# EAGLE design parallel_jtag_programmer (EAGLE 7.6.0)
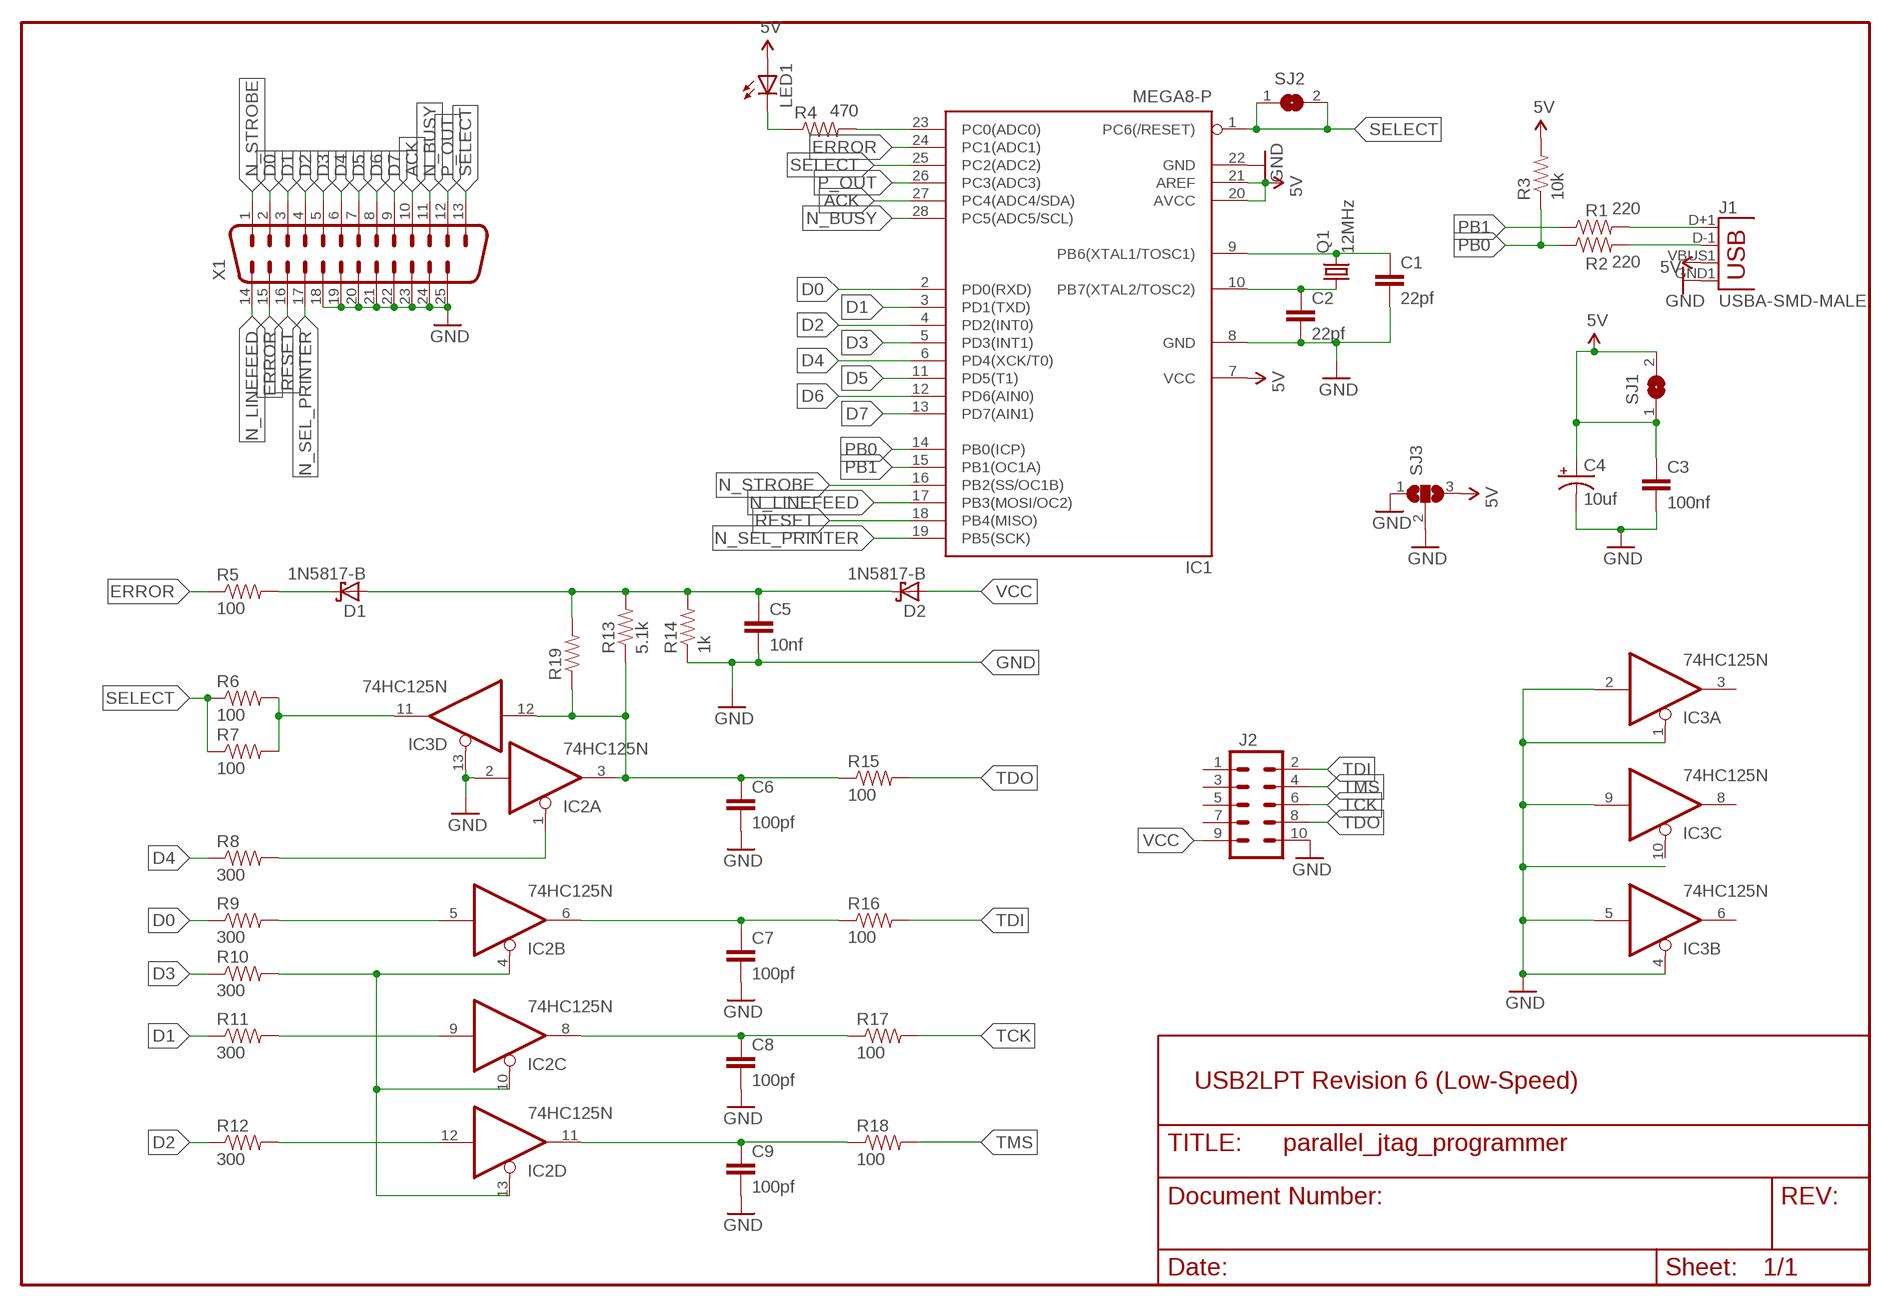
[diagram p0: schematic, sheet 1]

## Parts
C1  22pf  CAPPTH  [CAP-PTH-SMALL]
C2  22pf  CAPPTH  [CAP-PTH-SMALL]
C3  100nf  CAPPTH1  [CAP-PTH-5MM]
C4  10uf  CAP_POLPTH2  [CPOL-RADIAL-10UF-25V]
C5  10nf  CAPPTH  [CAP-PTH-SMALL]
C6  100pf  CAPPTH1  [CAP-PTH-5MM]
C7  100pf  CAPPTH1  [CAP-PTH-5MM]
C8  100pf  CAPPTH1  [CAP-PTH-5MM]
C9  100pf  CAPPTH1  [CAP-PTH-5MM]
D1  1N5817-B  [DO41-7.6]
D2  1N5817-B  [DO41-7.6]
IC1  MEGA8-P  [DIL28-3]
IC2  74HC125N  [DIL14]
IC3  74HC125N  [DIL14]
J1  USBA-SMD-MALE  [USB-A-SMT-MALE]
J2  M05X2SHD  [2X5-SHROUDED]
LED1  LED3MM  [LED3MM]
Q1  12MHz  CRYSTALHC49U-V  [HC49U-V]
R1  220  RESISTORAXIAL-0.3  [AXIAL-0.3]
R2  220  RESISTORAXIAL-0.3  [AXIAL-0.3]
R3  10k  RESISTORAXIAL-0.3  [AXIAL-0.3]
R4  470  RESISTORAXIAL-0.3  [AXIAL-0.3]
R5  100  RESISTORAXIAL-0.3  [AXIAL-0.3]
R6  100  RESISTORAXIAL-0.3  [AXIAL-0.3]
R7  100  RESISTORAXIAL-0.3  [AXIAL-0.3]
R8  300  RESISTORAXIAL-0.3  [AXIAL-0.3]
R9  300  RESISTORAXIAL-0.3  [AXIAL-0.3]
R10  300  RESISTORAXIAL-0.3  [AXIAL-0.3]
R11  300  RESISTORAXIAL-0.3  [AXIAL-0.3]
R12  300  RESISTORAXIAL-0.3  [AXIAL-0.3]
R13  5.1k  RESISTORAXIAL-0.3  [AXIAL-0.3]
R14  1k  RESISTORAXIAL-0.3  [AXIAL-0.3]
R15  100  RESISTORAXIAL-0.3  [AXIAL-0.3]
R16  100  RESISTORAXIAL-0.3  [AXIAL-0.3]
R17  100  RESISTORAXIAL-0.3  [AXIAL-0.3]
R18  100  RESISTORAXIAL-0.3  [AXIAL-0.3]
R19  RESISTORAXIAL-0.3  [AXIAL-0.3]
SJ1  SJ  [SJ]
SJ2  SJ  [SJ]
SJ3  SJ2W  [SJ_2]
X1  DB25H  [M25H]

## Nets
5V: C3.1 C4.1(+) IC1.7(VCC) IC1.20(AVCC) IC1.21(AREF) J1.VBUS1(VBUS) LED1.A R3.P$2 SJ1.1 SJ1.2 SJ3.3
ACK: IC1.27(PC4(ADC4/SDA)) X1.10
D0: IC1.2(PD0(RXD)) R9.P$1 X1.2
D1: IC1.3(PD1(TXD)) R11.P$1 X1.3
D2: IC1.4(PD2(INT0)) R12.P$1 X1.4
D3: IC1.5(PD3(INT1)) R10.P$1 X1.5
D4: IC1.6(PD4(XCK/T0)) R8.P$1 X1.6
D5: IC1.11(PD5(T1)) X1.7
D6: IC1.12(PD6(AIN0)) X1.8
D7: IC1.13(PD7(AIN1)) X1.9
ERROR: IC1.24(PC1(ADC1)) R5.P$1 X1.15
GND: C1.2 C2.2 C3.2 C4.2(-) C5.2 C6.2 C7.2 C8.2 C9.2 IC1.8(GND) IC1.22(GND) IC2.2(A:I) IC3.1(A:OE) IC3.2(A:I) IC3.4(B:OE) IC3.5(B:I) IC3.9(C:I) IC3.13(D:OE) J1.GND1(GND) J2.10 R14.P$1 SJ3.1 SJ3.2 X1.18 X1.19 X1.20 X1.21 X1.22 X1.23 X1.24 X1.25
N$1: LED1.K(C) R4.P$1
N$2: IC1.23(PC0(ADC0)) R4.P$2
N$3: C5.1 D1.A D2.C R13.P$2 R14.P$2 R19.P$2
N$4: C2.1 IC1.10(PB7(XTAL2/TOSC2)) Q1.1
N$5: C1.1 IC1.9(PB6(XTAL1/TOSC1)) Q1.2
N$6: J1.D-1(D-) R2.P$2
N$7: J1.D+1(D+) R1.P$2
N$9: C6.1 IC2.3(A:O) IC3.12(D:I) R13.P$1 R15.P$1 R19.P$1
N$10: IC2.1(A:OE) R8.P$2
N$11: IC3.11(D:O) R6.P$2 R7.P$2
N$13: IC2.5(B:I) R9.P$2
N$14: IC2.4(B:OE) IC2.10(C:OE) IC2.13(D:OE) R10.P$2
N$15: D1.C R5.P$2
N$16: C7.1 IC2.6(B:O) R16.P$1
N$18: C8.1 IC2.8(C:O) R17.P$1
N$19: IC2.9(C:I) R11.P$2
N$20: IC2.12(D:I) R12.P$2
N$23: C9.1 IC2.11(D:O) R18.P$1
N_BUSY: IC1.28(PC5(ADC5/SCL)) X1.11
N_LINEFEED: IC1.17(PB3(MOSI/OC2)) X1.14
N_SEL_PRINTER: IC1.19(PB5(SCK)) X1.17
N_STROBE: IC1.16(PB2(SS/OC1B)) X1.1
P_OUT: IC1.26(PC3(ADC3)) X1.12
PB0: IC1.14(PB0(ICP)) R2.P$1 R3.P$1
PB1: IC1.15(PB1(OC1A)) R1.P$1
RESET: IC1.18(PB4(MISO)) X1.16
SELECT: IC1.1(PC6(/RESET)) IC1.25(PC2(ADC2)) R6.P$1 R7.P$1 SJ2.1 SJ2.2 X1.13
TCK: J2.6
TDI: J2.2 R16.P$2
TDO: J2.8 R15.P$2
TMS: J2.4 R18.P$2
VCC: D2.A J2.9
Unconnected: IC3.3(A:O) IC3.6(B:O) IC3.8(C:O) IC3.10(C:OE) J2.1 J2.3 J2.5 J2.7 R17.P$2

## Notes on the sheet
- USB2LPT Revision 6 (Low-Speed)

## Power pins joined to a net without a drawn wire
GND: IC2.7(P:GND) IC3.7(P:GND)
VCC: IC2.14(P:VCC) IC3.14(P:VCC)

## Library data of the parts
C1-C3 C5-C9 = SparkFun-Passives:CAP: Capacitor Standard 0603 ceramic capacitor, and 0.1" leaded capacitor.
C4 = SparkFun-Passives:CAP_POL: Capacitor Polarized These are standard SMD and PTH capacitors. Normally 10uF, 47uF, and 100uF in electrolytic and tantalum varieties. Always verify the external diameter of the through hole cap, it varies with capacity, voltage, and manufacturer. The EIA devices should be standard.
D1 D2 = diode:1N581*: 1.0A SCHOTTKY BARRIER RECTIFIER Source: http://www.diodes.com/datasheets/ds23001.pdf
IC1 = atmel:MEGA8-P: MICROCONTROLLER 8 Kbytes FLASH, 1 kbytes SRAM, 512 bytes EEPROM, USART, 4-channel 10 bit ADC, 2-channel 8 bit ADC Pin compatible with Atmega48, ATMega88, ATMega168 Source: avr.lbr; OC_FARNELL: unknown; OC_NEWARK: unknown
IC2 IC3 = 74xx-eu:74*125: Quad bus BUFFER, 3-state
J1 = SparkFun-Connectors:USB: USB Connectors USB-B-PTH is fully proven SKU : PRT-00139/CONN-08278 USB-miniB is fully proven SKU : PRT-00587 USB-A-PCB is untested. USB-A-H is throughly reviewed, but untested. Spark Fun Electronics SKU : PRT-00437 USB-B-SMT is throughly reviewed, but untested. Needs silkscreen touching up. USB-A-S has not been used/tested USB-MB-H has not been used/tested USB-MICROB has been used. CONN-09505
J2 = SparkFun-Connectors:M05X2: Header 5x2 Standard 10-pin dual row 0.1" header. Commonly used with AVR-ISP. Use with Spark Fun Electronics SKU: PRT-00778
LED1 = adafruit:LED: LED OSRAM: - CHIPLED LG R971, LG N971, LY N971, LG Q971, LY Q971, LO R971, LY R971 LH N974, LH R974 LS Q976, LO Q976, LY Q976 LO Q996 - Hyper CHIPLED LW Q18S LB Q993, LB Q99A, LB R99A - SideLED LS A670, LO A670, LY A670, LG A670, LP A670 LB A673, LV A673, LT A673, LW A673 LH A674 LY A675 LS A676, LA A676, LO A676, LY A676, LW A676 LS A679, LY A679, LG A679 - Hyper Micro SIDELED® LS Y876, LA Y876, LO Y876, LY Y876 LT Y87S - SmartLED LW L88C, LW L88S LB L89C, LB L89S, LG L890 LS L89K, LO L89K, LY L89K LS L896, LA L896, LO L896, LY L896 - TOPLED LS T670, LO T670, LY T670, LG T670, LP T670 LSG T670, LSP T670, LSY T670, LOP T670, LYG T670 LG T671, LOG T671, LSG T671 LB T673, LV T673, LT T673, LW T673 LH T674 LS T676, LA T676, LO T676, LY T676, LB T676, LH T676, LSB T676, LW T676 LB T67C, LV T67C, LT T67C, LS T67K, LO T67K, LY T67K, LW E67C LS E67B, LA E67B, LO E67B, LY E67B, LB E67C, LV E67C, LT E67C LW T67C LS T679, LY T679, LG T679 LS T770, LO T770, LY T770, LG T770, LP T770 LB T773, LV T773, LT T773, LW T773 LH T774 LS E675, LA E675, LY E675, LS T675 LS T776, LA T776, LO T776, LY T776, LB T776 LHGB T686 LT T68C, LB T68C - Hyper Mini TOPLED® LB M676 - Mini TOPLED Santana® LG M470 LS M47K, LO M47K, LY M47K Source: http://www.osram.convergy.de/
Q1 = crystal:CRYSTAL: CRYSTAL; OC_FARNELL: 1666969; OC_NEWARK: unknown
R1-R19 = SparkFun-Passives:RESISTOR: Resistor Basic schematic elements and footprints for 0603, 1206, and PTH resistors.
SJ1 SJ2 = jumper:SJ: SMD solder JUMPER
SJ3 = jumper:SJ2W: SMD solder JUMPER
X1 = SparkFun-Connectors:DB25: Various DB25 connectors

## Board
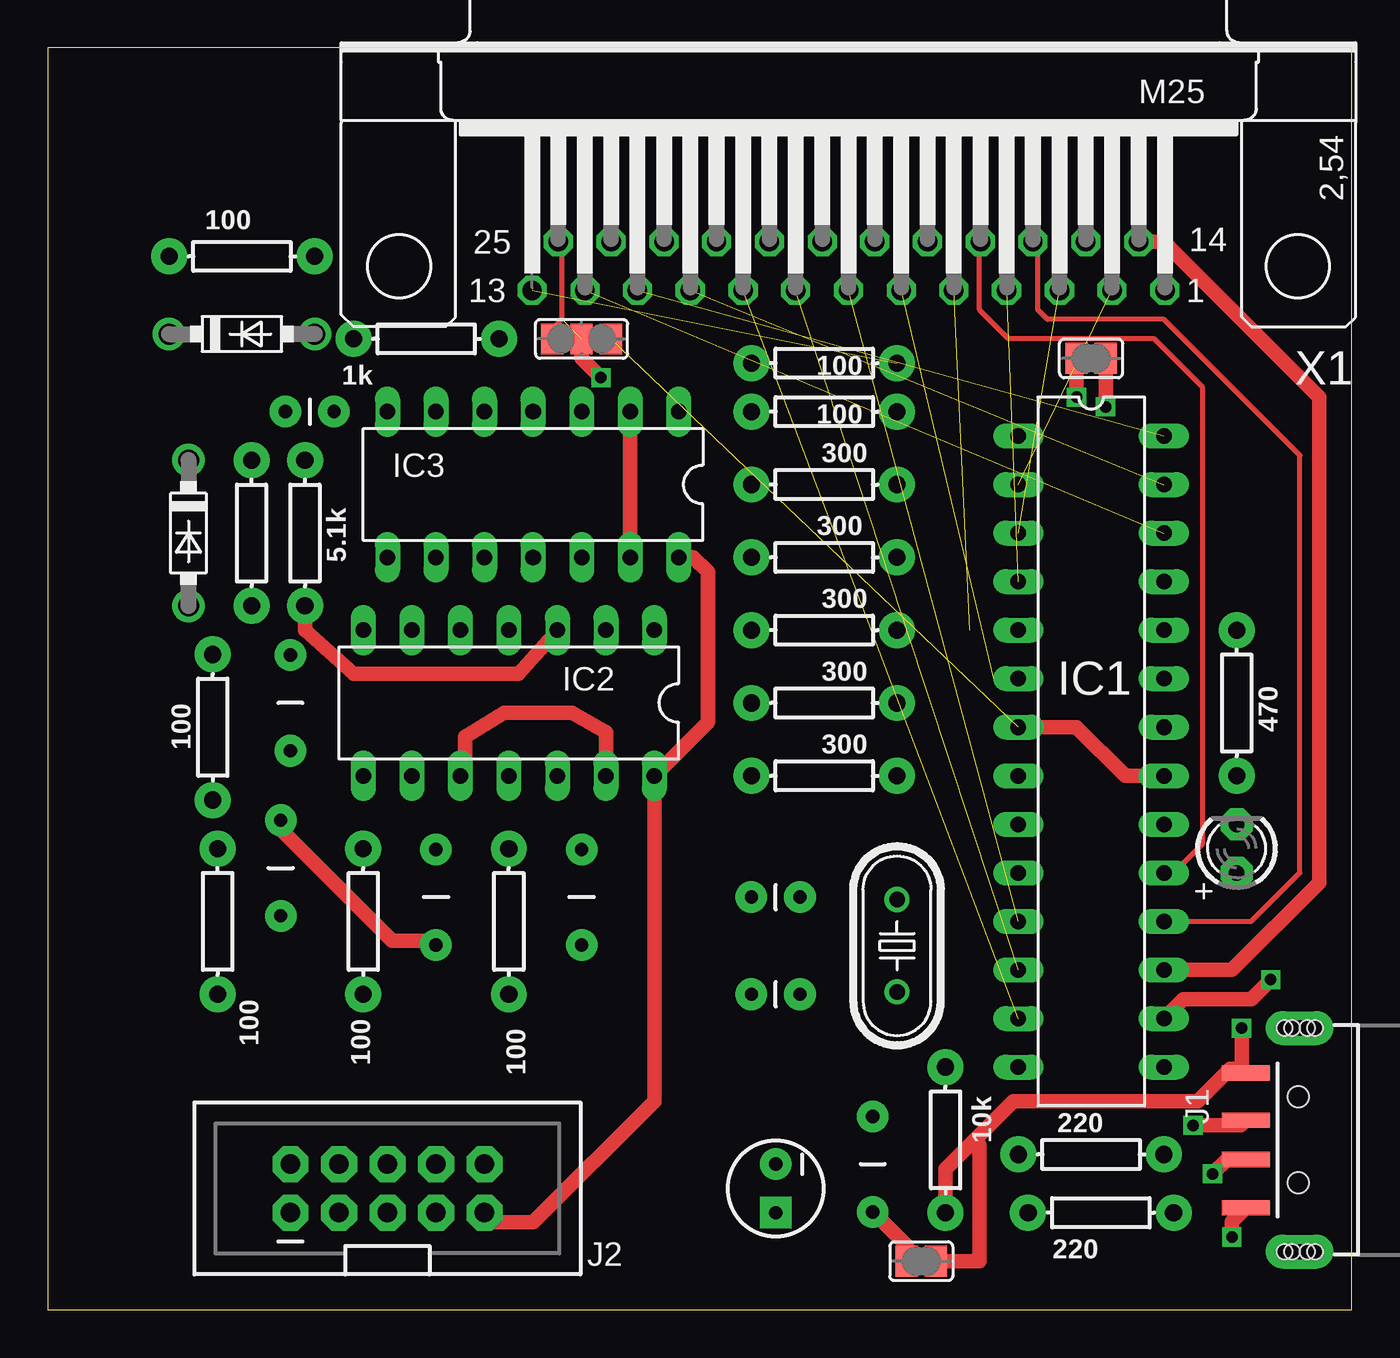
[diagram p1: board, top side]
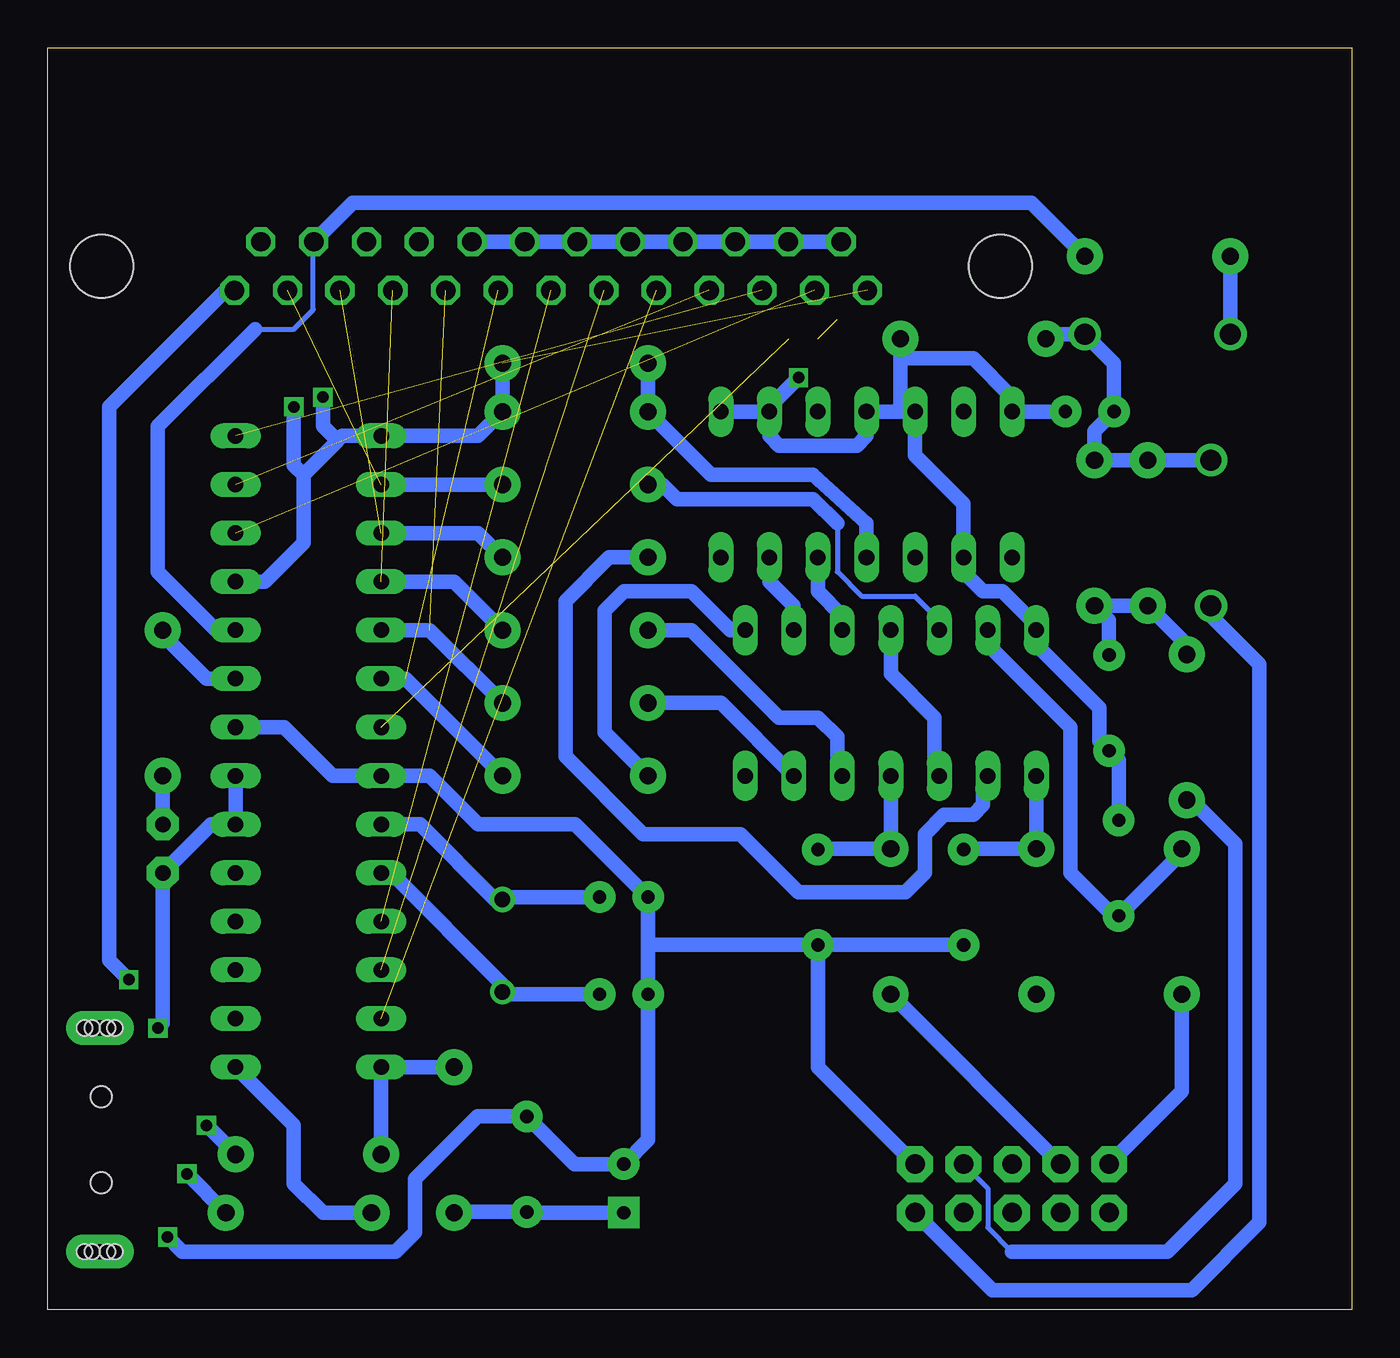
[diagram p2: board, bottom side, seen from below]

Size 68.25 x 66.03 mm. Coordinates in mm from the lower left corner, seen from the top.
Outline: 0,0 68.25,0 68.25,66.03 0,66.03 0,0
Copper layers (1*16): Top 0.035mm / dielectric 1.5mm / Bottom 0.035mm
Design rules "default": minimum track width 10mil, minimum drill 24mil, track to track 8mil, track to pad 8mil, pad to pad 8mil, via to via 8mil, smd to smd 8mil, copper to edge 40mil, drill to drill 8mil, minimum pad ring 10mil, minimum via ring 8mil, stop-mask expansion 4mil, vias tented up to drill 0mil, thermal gap 10mil

### Footprints (pad centres in the part's own frame; a part is rotated, then mirrored left to right if it is on the bottom)
CAP-PTH-SMALL = drill 0.7 pad 1.651: 1 0,0; 2 2.54,0
CAP-PTH-5MM = drill 0.7 pad 1.651: 1 -2.5,0; 2 2.5,0
CPOL-RADIAL-10UF-25V = drill 0.7 pad 1.651 square: 1 1.27,0 | drill 0.7 pad 1.651: 2 -1.27,0
DO41-7.6 = drill 1.1 pad 1.7: A 3.81,0; C -3.81,0
DIL28-3 = drill 0.813 long: 1 -16.51,-3.81; 2 -13.97,-3.81; 3 -11.43,-3.81; 4 -8.89,-3.81; 5 -6.35,-3.81; 6 -3.81,-3.81; 7 -1.27,-3.81; 8 1.27,-3.81; 9 3.81,-3.81; 10 6.35,-3.81; 11 8.89,-3.81; 12 11.43,-3.81; 13 13.97,-3.81; 14 16.51,-3.81; 15 16.51,3.81; 16 13.97,3.81; 17 11.43,3.81; 18 8.89,3.81; 19 6.35,3.81; 20 3.81,3.81; 21 1.27,3.81; 22 -1.27,3.81; 23 -3.81,3.81; 24 -6.35,3.81; 25 -8.89,3.81; 26 -11.43,3.81; 27 -13.97,3.81; 28 -16.51,3.81
DIL14 = drill 0.813 long: 1 -7.62,-3.81; 2 -5.08,-3.81; 3 -2.54,-3.81; 4 0,-3.81; 5 2.54,-3.81; 6 5.08,-3.81; 7 7.62,-3.81; 8 7.62,3.81; 9 5.08,3.81; 10 2.54,3.81; 11 0,3.81; 12 -2.54,3.81; 13 -5.08,3.81; 14 -7.62,3.81
USB-A-SMT-MALE = smd 0.8 x 2.5: D+1 1.027,-5.87; D-1 -1.027,-5.87; GND1 3.551,-5.87; VBUS1 -3.5,-5.87 | drill 0.8 pad 1.778 long: P$1 5.85,-3.05; P$3 -5.85,-3.05 | hole 1.1: 2.25,-3.12; -2.25,-3.12 | hole 0.8: -5.85,-3.45; -5.85,-3.85; -5.85,-2.65; -5.85,-2.25; 5.85,-3.45; 5.85,-3.85; 5.85,-2.65; 5.85,-2.25
2X5-SHROUDED = drill 1.016 pad 1.88 octagon: 1 -1.27,5.08; 2 1.27,5.08; 3 -1.27,2.54; 4 1.27,2.54; 5 -1.27,0; 6 1.27,0; 7 -1.27,-2.54; 8 1.27,-2.54; 9 -1.27,-5.08; 10 1.27,-5.08
LED3MM = drill 0.813 pad 1.676 octagon: A -1.27,0; K 1.27,0
HC49U-V = drill 0.813: 1 -2.413,0; 2 2.413,0
AXIAL-0.3 = drill 0.9 pad 1.88: P$1 -3.81,0; P$2 3.81,0
SJ = smd 1.168 x 1.6: 1 -0.762,0; 2 0.762,0
SJ_2 = smd 1.168 x 1.6: 1 -1.524,0; 2 0,0; 3 1.524,0
M25H = drill 1.016 octagon: 1 -16.561,1.27; 2 -13.792,1.27; 3 -11.049,1.27; 4 -8.28,1.27; 5 -5.512,1.27; 6 -2.769,1.27; 7 0,1.27; 8 2.769,1.27; 9 5.512,1.27; 10 8.28,1.27; 11 11.049,1.27; 12 13.792,1.27; 13 16.561,1.27; 14 -15.189,-1.27; 15 -12.421,-1.27; 16 -9.652,-1.27; 17 -6.909,-1.27; 18 -4.14,-1.27; 19 -1.372,-1.27; 20 1.372,-1.27; 21 4.14,-1.27; 22 6.909,-1.27; 23 9.652,-1.27; 24 12.421,-1.27; 25 15.189,-1.27 | hole 3.302: 23.52,0; -23.52,0

### Placement (x,y rotation side)
C1  39.37,21.59 180 top
C2  39.37,16.51 180 top
C3  43.18,7.62 90 top
C4  38.1,6.35 270 top
C5  12.45,46.99 0 top
C6  12.7,31.75 270 top
C7  12.19,23.11 90 top
C8  20.32,21.59 270 top
C9  27.94,21.59 270 top
D1  10.16,51.05 0 top
D2  7.37,40.64 270 top
IC1  54.61,29.21 270 top
IC2  24.13,31.75 180 top
IC3  25.4,43.18 180 top
J1  68.58,8.89 270 top
J2  17.78,6.35 90 top
LED1  62.23,24.13 90 top
Q1  44.45,19.05 90 top
R1  55.12,5.08 0 top
R2  54.61,8.13 0 top
R3  46.99,8.89 270 top
R4  62.23,31.75 90 top
R5  10.16,55.12 180 top
R6  40.64,49.53 180 top
R7  40.64,46.99 180 top
R8  40.64,27.94 180 top
R9  40.64,43.18 180 top
R10  40.64,31.75 180 top
R11  40.64,39.37 180 top
R12  40.64,35.56 180 top
R13  13.46,40.64 90 top
R14  19.81,50.8 180 top
R15  8.64,30.48 270 top
R16  8.89,20.32 270 top
R17  16.51,20.32 270 top
R18  24.13,20.32 270 top
R19  10.67,40.64 90 top
SJ1  45.72,2.54 180 top
SJ2  54.61,49.78 0 top
SJ3  27.94,50.8 0 top
X1  41.91,54.61 180 top

### Tracks (layer width: path | path; a pad name or v marks a point on that pad's centre or on a via)
5V  (via drill 0.6)  (1 unrouted)
  Top 0.762: v62.48,14.73 62.48,12.62 | 62.48,12.62 J1.VBUS1 | IC1.7 53.85,30.48 56.39,27.94 IC1.21 | 62.48,12.62 61.89,12.62 60.2,10.92 50.55,10.92 48.51,8.89 | 48.51,8.89 46.99,7.37 R3.P$2 | SJ1.1 48.77,2.54 48.77,8.64 48.51,8.89 | SJ1.2 44.96,3.34 C3.1
  Bottom 0.762: IC1.21 IC1.20 59.69,25.4 LED1.A 62.23,14.99 v62.48,14.73 | C4.1 43.14,5.08 C3.1 46.95,5.12 R3.P$2
ACK  (1 unrouted)
D0  (1 unrouted)
  Bottom 0.762: R9.P$1 IC1.2
D1  (1 unrouted)
  Bottom 0.762: R11.P$1 45.72,40.64 IC1.3
D2  (1 unrouted)
  Bottom 0.762: IC1.4 46.99,38.1 R12.P$1
D3  (1 unrouted)
  Bottom 0.762: IC1.5 48.26,35.56 R10.P$1
D4  (1 unrouted)
  Bottom 0.762: IC1.6 49.53,33.02 R8.P$1
D5  (1 unrouted)
D6  (1 unrouted)
D7  (1 unrouted)
ERROR
  Bottom 0.254: 57.4,51.31 55.37,51.31 54.36,52.32 54.36,55.85 X1.15
  Bottom 0.762: R5.P$1 16.76,57.91 52.3,57.91 X1.15 | IC1.24 59.44,35.56 62.48,38.61 62.48,46.23 57.4,51.31
GND  (via drill 0.6)  (1 unrouted)
  Top 0.254: SJ3.1 26.42,51.31 26.92,51.82 26.92,55.68 X1.25
  Top 0.762: v28.96,48.77 27.94,49.78 SJ3.2 | C7.2 12.19,25.15 18.03,19.3 20.11,19.3 C8.2 | v61.98,3.81 61.98,4.61 J1.GND1 | IC3.13 IC3.2
  Bottom 0.762: 36.83,19.3 C1.2 40.64,25.4 45.72,25.4 48.26,27.94 IC1.8 53.34,27.94 55.88,30.48 IC1.22 | 36.83,19.3 C2.2 36.83,8.89 C4.2 40.68,7.62 C3.2 45.76,10.12 49.02,6.86 49.02,4.06 50.04,3.05 61.21,3.05 v61.98,3.81 | IC3.2 IC3.1 | 23.88,46.99 IC3.4 25.4,45.72 25.91,45.21 29.97,45.21 30.48,45.72 IC3.2 | 23.88,46.99 IC3.5 22.86,44.7 20.32,42.16 IC3.9 20.32,38.61 19.3,37.59 18.29,37.59 16.51,35.81 IC2.7 16.51,34.8 13.21,31.5 13.21,29.76 C6.2 12.19,28.74 C7.2 | R14.P$1 23.62,49.78 | 23.62,49.78 23.62,47.24 23.88,46.99 | C5.2 IC3.7 17.78,47.75 19.81,49.78 23.62,49.78 | X1.25 X1.24 X1.23 X1.22 X1.21 X1.20 X1.19 X1.18 | IC3.2 30.48,47.24 v28.96,48.77 | IC2.2 29.21,36.83 30.48,38.1 IC3.13 | C9.2 36.62,19.09 36.83,19.3 | C8.2 C9.2 | J2.10 27.94,12.7 C9.2
N$1
  Bottom 0.762: R4.P$1 LED1.K
N$2
  Bottom 0.762: R4.P$2 62.23,35.31 59.94,33.02 IC1.23
N$3
  Bottom 0.762: D2.C R19.P$2 R13.P$2 13.46,45.97 C5.1 12.45,49.53 D1.A 15.75,51.05 R14.P$2
N$4
  Bottom 0.762: IC1.10 50.29,22.86 44.45,17.02 Q1.1 44.32,16.51 C2.1
N$5
  Bottom 0.762: IC1.9 48.77,25.4 44.83,21.46 Q1.2 44.32,21.59 C1.1
N$6  (via drill 0.6)
  Top 0.762: v59.94,9.65 62.45,9.65 J1.D-1
  Bottom 0.762: R2.P$2 v59.94,9.65
N$7  (via drill 0.6)
  Top 0.762: J1.D+1 61.71,7.86 v60.96,7.11
  Bottom 0.762: v60.96,7.11 R1.P$2
N$9
  Top 0.762: R13.P$1 13.46,35.56 16,33.27 24.64,33.27 IC2.3
  Bottom 0.762: R15.P$1 8.64,34.8 R19.P$1 R13.P$1 12.7,36.07 C6.1 | IC2.3 26.67,36.32 27.94,37.59 IC3.12
N$10
  Bottom 0.762: IC2.1 32.51,35.56 34.54,37.59 38.1,37.59 39.12,36.58 39.12,30.23 R8.P$2
N$11
  Bottom 0.762: R6.P$2 R7.P$2 33.53,43.69 28.19,43.69 25.4,41.15 IC3.11
N$13
  Bottom 0.254: 26.92,41.15 26.92,38.61 25.65,37.34 22.86,37.34 22.1,36.58 22.1,36.07 IC2.5
  Bottom 0.762: R9.P$2 36.07,43.18 35.31,42.42 28.19,42.42 26.92,41.15
N$14
  Top 0.762: IC2.13 29.21,30.23 27.43,31.24 23.88,31.24 21.84,29.97 21.84,28.19 IC2.10
  Bottom 0.762: R10.P$2 33.02,31.75 IC2.13 | IC2.4 24.13,33.27 21.84,30.99 21.84,28.19 IC2.10
N$15
  Bottom 0.762: D1.C R5.P$2
N$16
  Bottom 0.762: IC2.6 19.05,34.8 14.73,30.48 14.73,22.86 12.49,20.61 C7.1 8.89,23.92 R16.P$1
N$18
  Bottom 0.762: IC2.8 R17.P$1 20.28,24.13 C8.1
N$19
  Bottom 0.762: R11.P$2 38.86,39.37 41.15,37.08 41.15,28.96 37.08,24.89 32,24.89 28.96,21.84 23.37,21.84 22.35,22.86 22.35,24.89 21.34,25.91 19.81,25.91 19.3,26.42 19.3,27.69 IC2.9
N$20
  Bottom 0.762: R12.P$2 34.54,35.56 29.97,30.99 27.94,30.99 26.92,29.97 26.92,28.19 IC2.12
N$23
  Bottom 0.762: IC2.11 R18.P$1 27.9,24.13 C9.1
N_BUSY  (1 unrouted)
N_LINEFEED
  Top 0.762: X1.14 58.42,55.88 66.55,47.75 66.55,22.35 61.98,17.78 IC1.17
N_SEL_PRINTER
  Top 0.254: IC1.19 58.93,22.86 60.45,24.38 60.45,48.26 57.91,50.8 50.29,50.8 48.77,52.32 48.77,55.83 X1.17
N_STROBE  (via drill 0.6)
  Top 0.762: v64.01,17.27 62.99,16.26 59.44,16.26 IC1.16
  Bottom 0.762: X1.1 58.93,53.34 65.02,47.24 65.02,18.29 v64.01,17.27
P_OUT  (1 unrouted)
PB0
  Bottom 0.762: R3.P$1 IC1.14 R2.P$1
PB1
  Bottom 0.762: R1.P$1 53.85,5.08 55.37,6.6 55.37,9.65 IC1.15
RESET
  Top 0.254: IC1.18 62.99,20.32 65.53,22.86 65.53,44.7 58.42,51.82 52.32,51.82 51.82,52.32 51.82,55.63 X1.16
SELECT  (via drill 0.6)  (1 unrouted)
  Top 0.762: SJ2.1 v53.85,47.75 | SJ2.2 v55.37,47.24
  Bottom 0.762: R6.P$1 R7.P$1 45.72,45.72 IC1.1 52.83,45.72 53.09,45.47 | IC1.25 56.9,38.1 54.86,40.13 54.86,43.69 | 54.86,43.69 53.09,45.47 | v53.85,47.75 53.85,46.23 53.09,45.47 | v55.37,47.24 55.37,44.2 54.86,43.69
TDI
  Bottom 0.762: R16.P$2 8.89,11.43 J2.2
TDO
  Bottom 0.254: 17.78,3.05 19.05,4.32 19.05,6.35 J2.8
  Bottom 0.762: R15.P$2 8.38,26.67 6.1,24.38 6.1,6.6 9.65,3.05 17.78,3.05
TMS
  Bottom 0.762: R18.P$2 J2.4
VCC
  Top 0.762: IC3.14 33.78,39.37 34.54,38.61 34.54,30.73 IC2.14 31.75,10.92 25.4,4.57 23.37,4.57 J2.9
  Bottom 0.762: D2.A 7.37,36.32 4.83,33.78 4.83,4.57 8.38,1.02 18.8,1.02 J2.9